# EAGLE design PL (EAGLE 9.4.2)
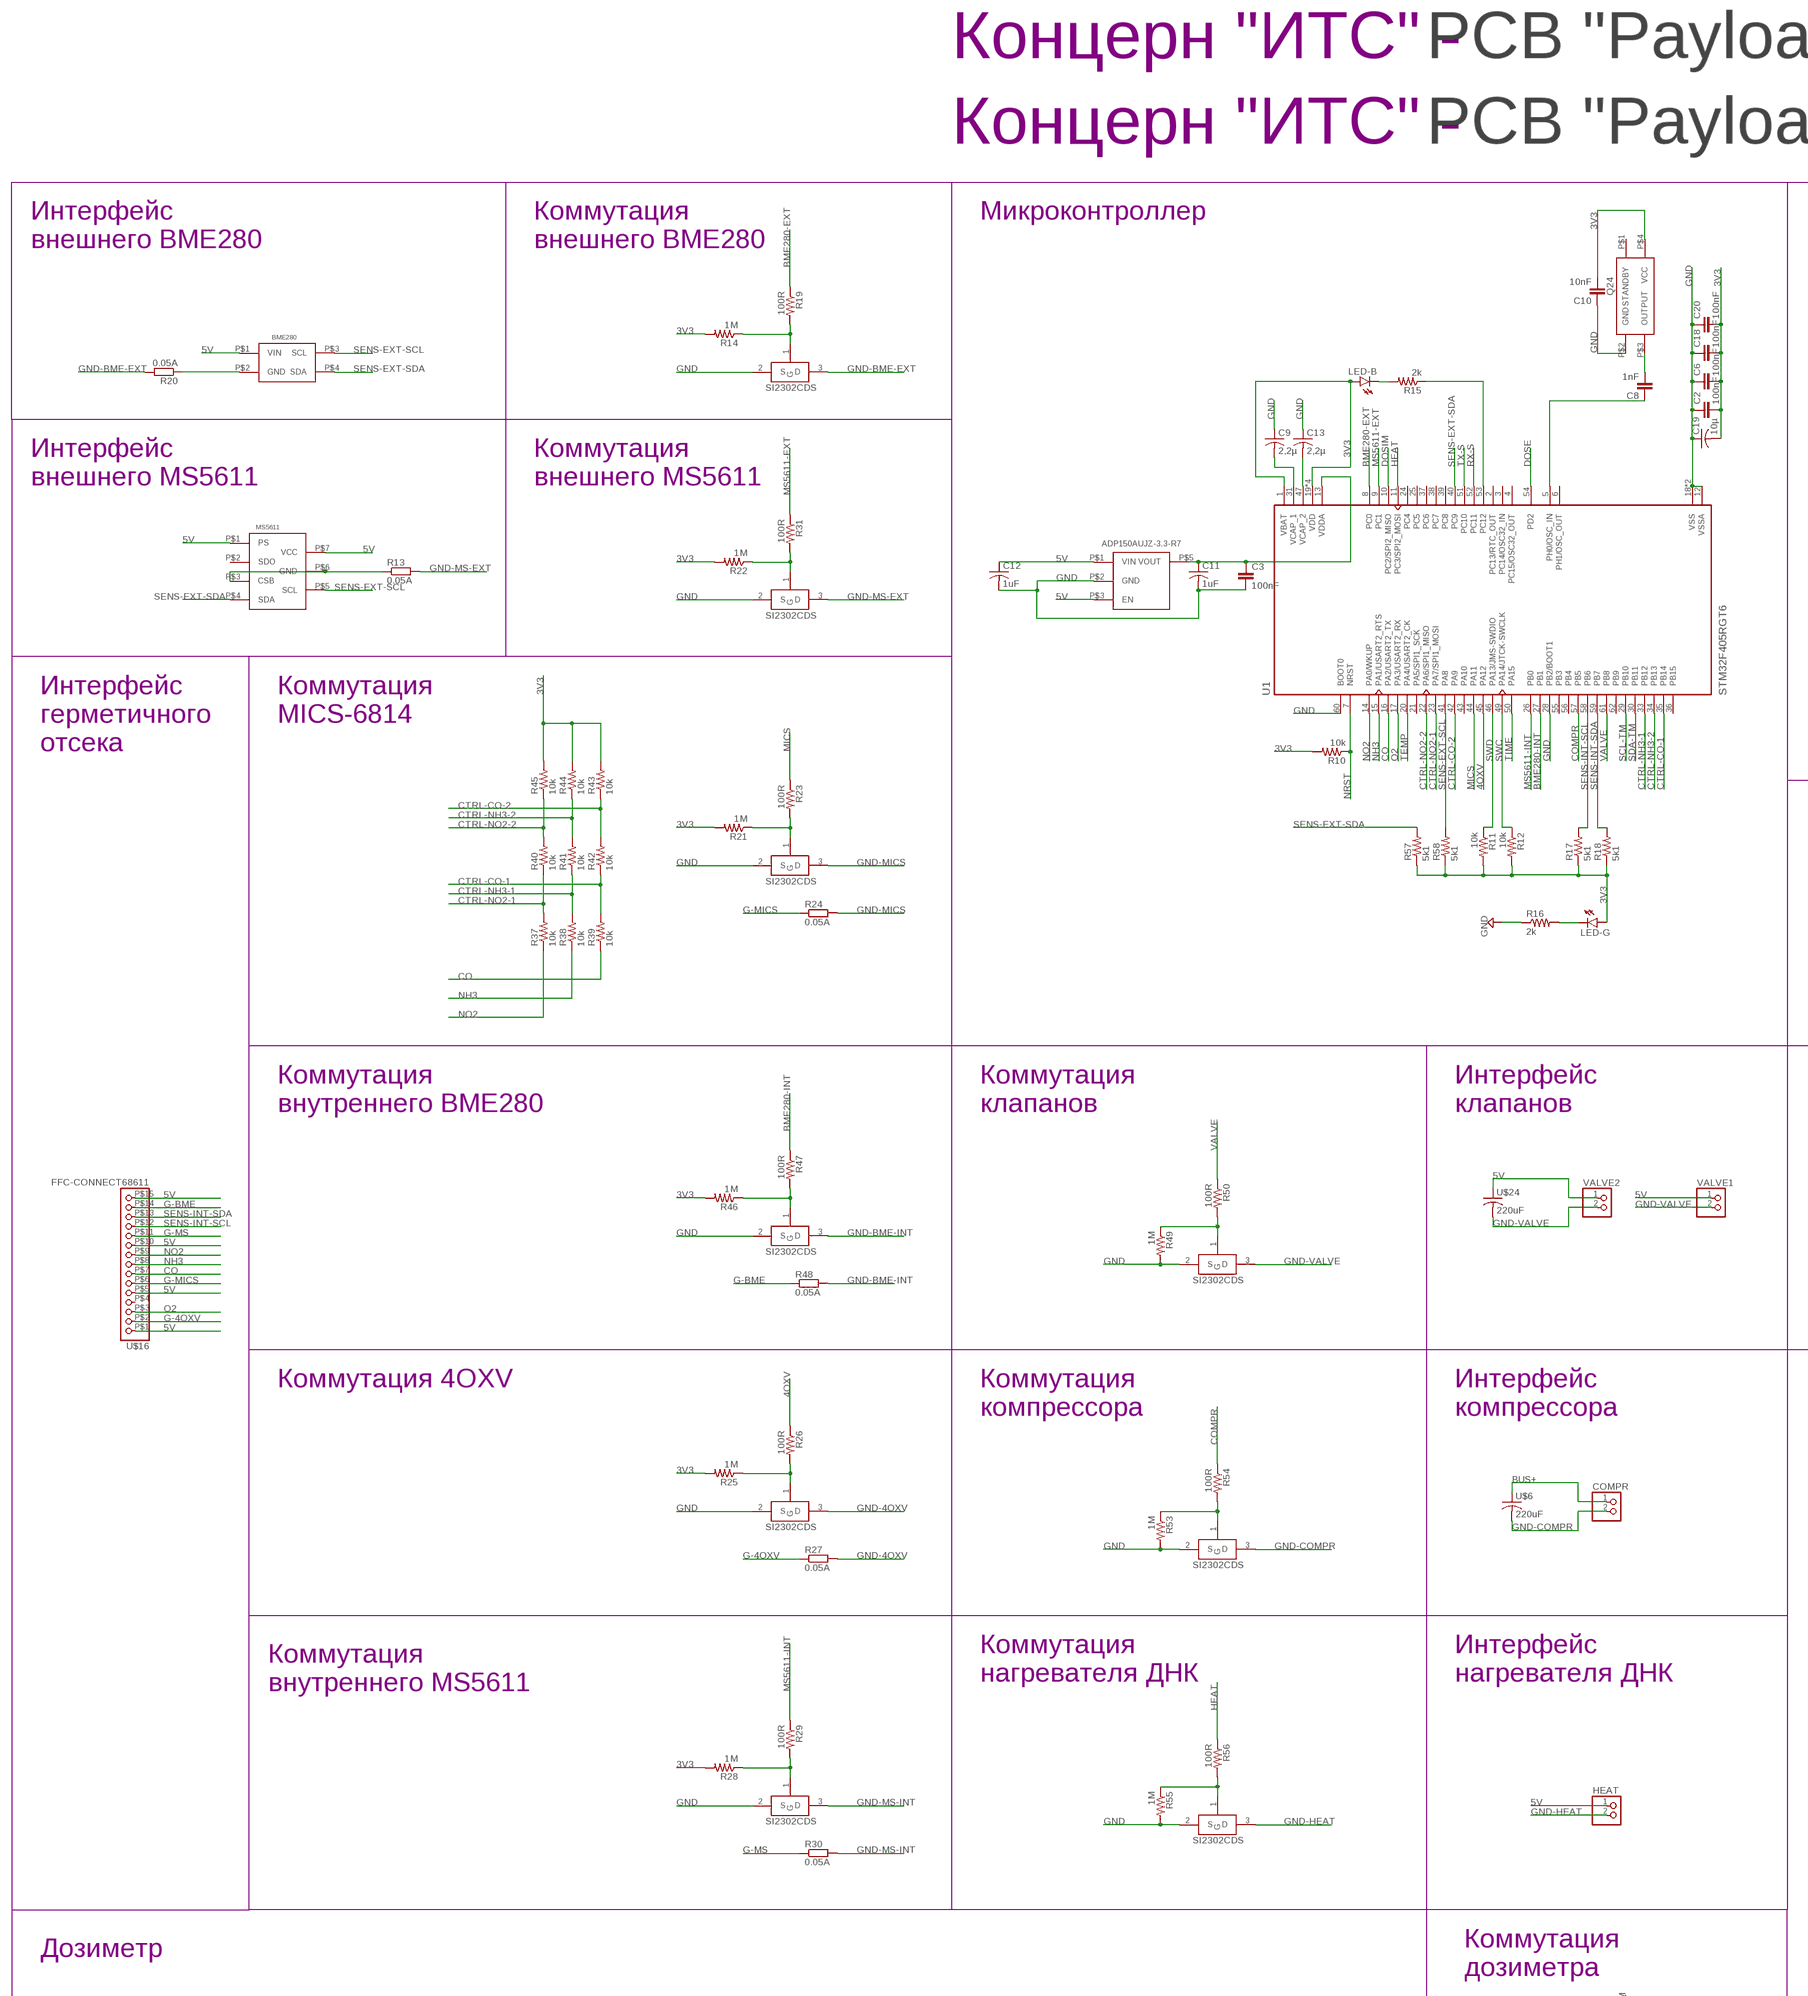
[diagram p0: schematic, sheet 1, part 1 of 3]
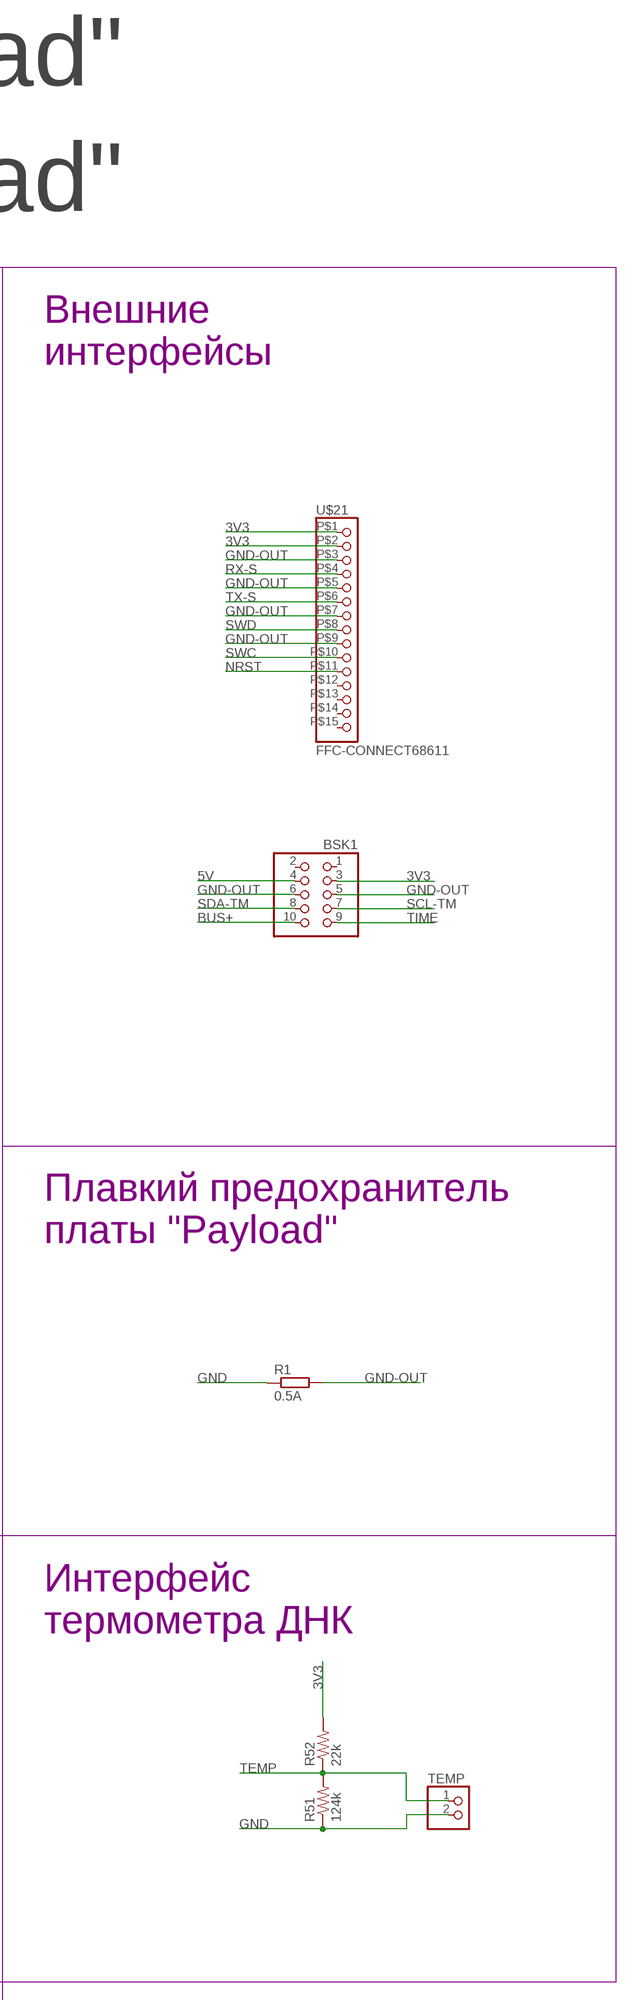
[diagram p1: schematic, sheet 1, part 2 of 3]
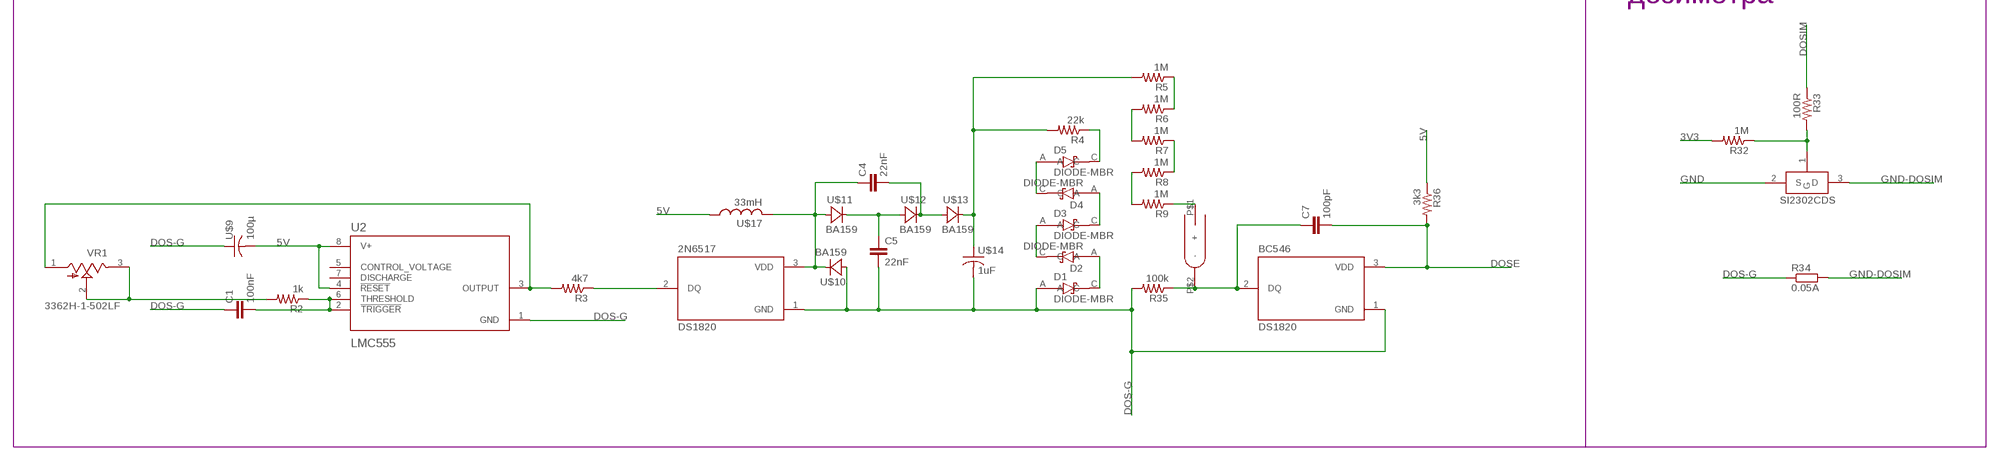
[diagram p2: schematic, sheet 1, part 3 of 3]

## Parts
2N6517  DS1820  [TO92/TO226]
BC546  DS1820  [TO92/TO226]
BME280  BME280BME280-PINS-ONLY  [BME280-PINS-ONLY]
BSK1  PINHD-2X5  [2X05]
C1  100nF  C-EUC0603  [C0603]
C2  100nF  C-EUC0603  [C0603]
C3  100nF  C-EUC0603  [C0603]
C4  22nF  C-EUC1210  [C1210]
C5  22nF  C-EUC1210  [C1210]
C6  100nF  C-EUC0603  [C0603]
C7  100pF  C-EUC0603  [C0603]
C8  1nF  C-EUC0603  [C0603]
C9  2,2µ  C-USC0603  [C0603]
C10  10nF  C-EUC0603  [C0603]
C11  1uF  ECAP1UF  [ECAP-SMD-D4]
C12  1uF  ECAP1UF  [ECAP-SMD-D4]
C13  2,2µ  C-USC0603  [C0603]
C18  100nF  C-EUC0603  [C0603]
C19  10µ  C-USC1206  [C1206]
C20  100nF  C-EUC0603  [C0603]
COMPR  PINHD-1X2  [1X02]
D1  DIODE-MBR  [SOD123]
D2  DIODE-MBR  [SOD123]
D3  DIODE-MBR  [SOD123]
D4  DIODE-MBR  [SOD123]
D5  DIODE-MBR  [SOD123]
HEAT  PINHD-1X2  [1X02]
LED-B  LEDCHIPLED_0603  [CHIPLED_0603]
LED-G  LEDCHIPLED_0603  [CHIPLED_0603]
MS5611  MS5611MS5611-PIN-ONLY  [MS5611-PINS-ONLY]
Q24  Q24  [Q24]
R1  0.5A  R-EU_R1210  [R1210]
R2  1k  R-US_R0603  [R0603]
R3  4k7  R-US_R0603  [R0603]
R4  22k  R-US_R0603  [R0603]
R5  1M  R-US_R0603  [R0603]
R6  1M  R-US_R0603  [R0603]
R7  1M  R-US_R0603  [R0603]
R8  1M  R-US_R0603  [R0603]
R9  1M  R-US_R0603  [R0603]
R10  10k  R-US_R0603  [R0603]
R11  10k  R-US_R0603  [R0603]
R12  10k  R-US_R0603  [R0603]
R13  0.05A  R-EU_R1210  [R1210]
R14  1M  R-US_R0603  [R0603]
R15  2k  R-US_R0603  [R0603]
R16  2k  R-US_R0603  [R0603]
R17  5k1  R-US_R0603  [R0603]
R18  5k1  R-US_R0603  [R0603]
R19  100R  R-US_R0603  [R0603]
R20  0.05A  R-EU_R1210  [R1210]
R21  1M  R-US_R0603  [R0603]
R22  1M  R-US_R0603  [R0603]
R23  100R  R-US_R0603  [R0603]
R24  0.05A  R-EU_R1210  [R1210]
R25  1M  R-US_R0603  [R0603]
R26  100R  R-US_R0603  [R0603]
R27  0.05A  R-EU_R1210  [R1210]
R28  1M  R-US_R0603  [R0603]
R29  100R  R-US_R0603  [R0603]
R30  0.05A  R-EU_R1210  [R1210]
R31  100R  R-US_R0603  [R0603]
R32  1M  R-US_R0603  [R0603]
R33  100R  R-US_R0603  [R0603]
R34  0.05A  R-EU_R1210  [R1210]
R35  100k  R-US_R0603  [R0603]
R36  3k3  R-US_R0603  [R0603]
R37  10k  R-US_R0603  [R0603]
R38  10k  R-US_R0603  [R0603]
R39  10k  R-US_R0603  [R0603]
R40  10k  R-US_R0603  [R0603]
R41  10k  R-US_R0603  [R0603]
R42  10k  R-US_R0603  [R0603]
R43  10k  R-US_R0603  [R0603]
R44  10k  R-US_R0603  [R0603]
R45  10k  R-US_R0603  [R0603]
R46  1M  R-US_R0603  [R0603]
R47  100R  R-US_R0603  [R0603]
R48  0.05A  R-EU_R1210  [R1210]
R49  1M  R-US_R0603  [R0603]
R50  100R  R-US_R0603  [R0603]
R51  124k  R-US_R0603  [R0603]
R52  22k  R-US_R0603  [R0603]
R53  1M  R-US_R0603  [R0603]
R54  100R  R-US_R0603  [R0603]
R55  1M  R-US_R0603  [R0603]
R56  100R  R-US_R0603  [R0603]
R57  5k1  R-US_R0603  [R0603]
R58  5k1  R-US_R0603  [R0603]
SI2302-0  SI2302CDS  [SOT23-3]
SI2302-1  SI2302CDS  [SOT23-3]
SI2302-2  SI2302CDS  [SOT23-3]
SI2302-3  SI2302CDS  [SOT23-3]
SI2302-4  SI2302CDS  [SOT23-3]
SI2302-5  SI2302CDS  [SOT23-3]
SI2302-6  SI2302CDS  [SOT23-3]
SI2302-7  SI2302CDS  [SOT23-3]
SI2302-8  SI2302CDS  [SOT23-3]
SI2302-9  SI2302CDS  [SOT23-3]
STAB  ADP150AUJZ-3.3-R7  [SOT23-5]
TEMP  PINHD-1X2  [1X02]
U1  STM32F405RGT6  [QFP50P1200X1200X160-64N]
U2  LMC555  LMC555CMX/NOPB  [SOIC127P599X175-8N]
U$1  PCB "Payload"  ITS-LOGOPCB-""  [ITS-LOGO]
U$6  220uF  ECAPECAP220  [ECAP220-CMD]
U$9  100µ  ECAPECAP100  [ECAP100-CMD]
U$10  BA159  [BA159]
U$11  BA159  [BA159]
U$12  BA159  [BA159]
U$13  BA159  [BA159]
U$14  1uF  ECAP  [ECAP1MK]
U$15  DOSIM  [DOSIM]
U$16  FFC-CONNECT68611  [68611]
U$17  33mH  RCH114NPRCH114NP  [RCH114NP]
U$21  FFC-CONNECT68611  [68611]
U$24  220uF  ECAPECAP220  [ECAP220-CMD]
U$26  PCB "Payload"  ITS-LOGOPCB-""  [ITS-LOGO]
VALVE1  PINHD-1X2  [1X02]
VALVE2  PINHD-1X2  [1X02]
VR1  3362H-1-502LF  [TRIM_3362H-1-502LF]

## Nets
3V3: BSK1.3 C2.2 C6.2 C10.2 C18.2 C19.2 C20.2 LED-B.A LED-G.A Q24.P$4(VCC) R10.2 R11.2 R12.2 R14.2 R17.1 R18.1 R21.2 R22.2 R25.2 R28.2 R32.2 R43.2 R44.2 R45.2 R46.2 R52.2 R57.1 R58.1 U1.1(VBAT) U1.19(VDD) U1.32(VDD) U1.48(VDD) U1.64(VDD) U$21.P$1 U$21.P$2
4OXV: R26.1 U1.45(PA12)
5V: BME280.P$1(VIN) BSK1.4 C12.P+ HEAT.1 MS5611.P$1(PS) MS5611.P$7(VCC) R36.1 STAB.P$1(VIN) STAB.P$3(EN) U2.4(!RESET!) U2.8(V+) U$9.P$2 U$16.P$1 U$16.P$5 U$16.P$10 U$16.P$15 U$17.P$1 U$24.P$1 VALVE1.1 VALVE2.1
BME280-EXT: R19.1 U1.8(PC0)
BME280-INT: R47.1 U1.27(PB1)
BUS+: BSK1.10 COMPR.1 U$6.P$1
CO: R39.1 U1.16(PA2/USART2_TX) U$16.P$7
COMPR: R54.1 U1.57(PB5)
CTRL-CO-1: R39.2 R42.1 U1.35(PB14)
CTRL-CO-2: R42.2 R43.1 U1.42(PA9)
CTRL-NH3-1: R38.2 R41.1 U1.33(PB12)
CTRL-NH3-2: R41.2 R44.1 U1.34(PB13)
CTRL-NO2-1: R37.2 R40.1 U1.23(PA7/SPI1_MOSI)
CTRL-NO2-2: R40.2 R45.1 U1.22(PA6/SPI1_MISO)
DOS-G: 2N6517.1(GND) BC546.1(GND) C1.1 C5.2 D1.A R34.1 R35.2 U2.1(GND) U$9.P$1 U$10.P$1(A) U$14.P$2
DOSE: BC546.3(VDD) C7.2 R36.2 U1.54(PD2)
DOSIM: R33.1 U1.10(PC2/SPI2_MISO)
G-4OXV: R27.1 U$16.P$2
G-BME: R48.1 U$16.P$14
G-MICS: R24.1 U$16.P$6
G-MS: R30.1 U$16.P$11
GND: C2.1 C3.2 C6.1 C9.1 C10.1 C11.P- C12.P- C13.1 C18.1 C19.1 C20.1 Q24.P$2(GND) R1.1 R16.1 R49.2 R51.1 R53.2 R55.2 SI2302-0.2(S) SI2302-1.2(S) SI2302-2.2(S) SI2302-3.2(S) SI2302-4.2(S) SI2302-5.2(S) SI2302-6.2(S) SI2302-7.2(S) SI2302-8.2(S) SI2302-9.2(S) STAB.P$2(GND) TEMP.2 U1.12(VSSA) U1.18(VSS) U1.28(PB2/BOOT1) U1.60(BOOT0) U1.63(VSS)
GND-4OXV: R27.2 SI2302-8.3(D)
GND-BME-EXT: R20.2 SI2302-2.3(D)
GND-BME-INT: R48.2 SI2302-5.3(D)
GND-COMPR: COMPR.2 SI2302-9.3(D) U$6.P$2
GND-DOSIM: R34.2 SI2302-4.3(D)
GND-HEAT: HEAT.2 SI2302-3.3(D)
GND-MICS: R24.2 SI2302-7.3(D)
GND-MS-EXT: R13.2 SI2302-1.3(D)
GND-MS-INT: R30.2 SI2302-6.3(D)
GND-OUT: BSK1.5 BSK1.6 R1.2 U$21.P$3 U$21.P$5 U$21.P$7 U$21.P$9
GND-VALVE: SI2302-0.3(D) U$24.P$2 VALVE1.2 VALVE2.2
HEAT: R56.1 U1.11(PC3/SPI2_MOSI)
MICS: R23.1 U1.44(PA11)
MS5611-EXT: R31.1 U1.9(PC1)
MS5611-INT: R29.1 U1.26(PB0)
N$1: MS5611.P$3(CSB) MS5611.P$6(GND) R13.1
N$2: R14.1 R19.2 SI2302-2.1(G)
N$3: BME280.P$2(GND) R20.1
N$4: C8.2 Q24.P$3(OUTPUT)
N$5: C8.1 U1.5(PH0/OSC_IN)
N$6: R21.1 R23.2 SI2302-7.1(G)
N$7: R49.1 R50.2 SI2302-0.1(G)
N$8: R25.1 R26.2 SI2302-8.1(G)
N$9: C3.1 C11.P+ STAB.P$5(VOUT) U1.13(VDDA)
N$10: R46.1 R47.2 SI2302-5.1(G)
N$11: R22.1 R31.2 SI2302-1.1(G)
N$12: R28.1 R29.2 SI2302-6.1(G)
N$13: LED-G.C R16.2
N$14: R32.1 R33.2 SI2302-4.1(G)
N$15: C1.2 R2.1 U2.2(!TRIGGER!) U2.6(THRESHOLD)
N$16: R2.2 VR1.2(WIPER) VR1.3(CW)
N$17: R3.2 U2.3(OUTPUT) VR1.1(CCW)
N$18: 2N6517.2(DQ) R3.1
N$19: 2N6517.3(VDD) C4.1 U$10.P$2(C) U$11.P$1(A) U$17.P$2
N$20: C5.1 U$11.P$2(C) U$12.P$1(A)
N$21: C4.2 U$12.P$2(C) U$13.P$1(A)
N$22: R4.2 R5.2 U$13.P$2(C) U$14.P$1
N$23: D1.C D2.A
N$24: D2.C D3.A
N$25: D3.C D4.A
N$26: D4.C D5.A
N$27: D5.C R4.1
N$28: R5.1 R6.1
N$29: C13.2 U1.47(VCAP_2)
N$30: R6.2 R7.2
N$31: R7.1 R8.1
N$32: R8.2 R9.2
N$33: R9.1 U$15.P$1(+)
N$34: BC546.2(DQ) C7.1 R35.1 U$15.P$2(-)
N$36: C9.2 U1.31(VCAP_1)
N$37: LED-B.C R15.2
N$38: R15.1 U1.53(PC12)
N$47: R53.1 R54.2 SI2302-9.1(G)
N$48: R55.1 R56.2 SI2302-3.1(G)
NH3: R38.1 U1.15(PA1/USART2_RTS) U$16.P$8
NO2: R37.1 U1.14(PA0/WKUP) U$16.P$9
NRST: R10.1 U1.7(NRST) U$21.P$11
O2: U1.17(PA3/USART2_RX) U$16.P$3
RX-S: U1.52(PC11) U$21.P$4
SCL-TM: BSK1.7 U1.29(PB10)
SDA-TM: BSK1.8 U1.30(PB11)
SENS-EXT-SCL: BME280.P$3(SCL) MS5611.P$5(SCL) R58.2 U1.41(PA8)
SENS-EXT-SDA: BME280.P$4(SDA) MS5611.P$4(SDA) R57.2 U1.40(PC9)
SENS-INT-SCL: R17.2 U1.58(PB6) U$16.P$12
SENS-INT-SDA: R18.2 U1.59(PB7) U$16.P$13
SWC: R12.1 U1.49(PA14/JTCK-SWCLK) U$21.P$10
SWD: R11.1 U1.46(PA13/JMS-SWDIO) U$21.P$8
TEMP: R51.2 R52.1 TEMP.1 U1.20(PA4/USART2_CK)
TIME: BSK1.9 U1.50(PA15)
TX-S: U1.51(PC10) U$21.P$6
VALVE: R50.1 U1.61(PB8)
Unconnected: BSK1.1 BSK1.2 MS5611.P$2(SDO) Q24.P$1(STANDBY) U1.2(PC13/RTC_OUT) U1.3(PC14/OSC32_IN) U1.4(PC15/OSC32_OUT) U1.6(PH1/OSC_OUT) U1.21(PA5/SPI1_SCK) U1.24(PC4) U1.25(PC5) U1.36(PB15) U1.37(PC6) U1.38(PC7) U1.39(PC8) U1.43(PA10) U1.55(PB3) U1.56(PB4) U1.62(PB9) U2.5(CONTROL_VOLTAGE) U2.7(DISCHARGE) U$16.P$4 U$21.P$12 U$21.P$13 U$21.P$14 U$21.P$15

## Notes on the sheet
- Микроконтроллер
- Интерфейс
  внешнего BME280
- Коммутация
  внешнего BME280
- Внешние
  интерфейсы
- Интерфейс
  внешнего MS5611
- Коммутация
  внешнего MS5611
- Коммутация
  MICS-6814
- Интерфейс
  герметичного 
  отсека
- Плавкий предохранитель
  платы "Payload"
- Коммутация
  внутреннего BME280
- Коммутация
  клапанов
- Интерфейс
  клапанов
- Интерфейс
  термометра ДНК
- Коммутация 4OXV
- Коммутация
  компрессора
- Интерфейс
  компрессора
- Коммутация
  нагревателя ДНК
- Интерфейс
  нагревателя ДНК
- Коммутация
  внутреннего MS5611
- Дозиметр
- Коммутация
  дозиметра

## Library data of the parts
2N6517 BC546 = CanCubeSat:DS1820: Temperature Sensor Digital, Local -55°C ~ 125°C 7 b TO-92-3 Check prices <https://pricing.snapeda.com/parts/DS1820/Maxim%20Integrated/view-part?ref=eda>; AVAILABILITY: Bad; DESCRIPTION: Temperature Sensor Digital, Local -55°C ~ 125°C 9 b TO-92-3; MF: Maxim Integrated; MP: DS1820; PACKAGE: TO-226-3 Maxim; PRICE: None
BME280 = CanCubeSat:BME280
BSK1 = pinheadCS:PINHD-2X5: PIN HEADER
C1-C8 C10 C18 C20 = rcl:C-EU: CAPACITOR, European symbol; SPICEPREFIX: C
C9 C13 C19 = rcl:C-US: CAPACITOR, American symbol; SPICEPREFIX: C
C11 C12 U$6 U$9 U$14 U$24 = CanCubeSat:ECAP
COMPR HEAT TEMP VALVE1 VALVE2 = pinheadCS:PINHD-1X2: PIN HEADER
D1-D5 = CanCubeSat:DIODE-MBR: Rectifier, Schottky Power; Plastic Sod-123; 0.5 a @ +90c If; +125; 20v; 1000 Check prices <https://pricing.snapeda.com/parts/MBR0520LT1G/ON%20Semiconductor/view-part?ref=eda>; AVAILABILITY: Good; DESCRIPTION: Diode Schottky 20V 500mA Surface Mount SOD-123; MF: ON Semiconductor; MP: MBR0520LT1G; PACKAGE: SOD-123-2 ON Semiconductor; PRICE: None; PURCHASE-URL: https://pricing.snapeda.com/search/part/MBR0520LT1G/?ref=eda
LED-B LED-G = led:LED: LED OSRAM: - CHIPLED LG R971, LG N971, LY N971, LG Q971, LY Q971, LO R971, LY R971 LH N974, LH R974 LS Q976, LO Q976, LY Q976 LO Q996 - Hyper CHIPLED LW Q18S LB Q993, LB Q99A, LB R99A - SideLED LS A670, LO A670, LY A670, LG A670, LP A670 LB A673, LV A673, LT A673, LW A673 LH A674 LY A675 LS A676, LA A676, LO A676, LY A676, LW A676 LS A679, LY A679, LG A679 - Hyper Micro SIDELED® LS Y876, LA Y876, LO Y876, LY Y876 LT Y87S - SmartLED LW L88C, LW L88S LB L89C, LB L89S, LG L890 LS L89K, LO L89K, LY L89K LS L896, LA L896, LO L896, LY L896 - TOPLED LS T670, LO T670, LY T670, LG T670, LP T670 LSG T670, LSP T670, LSY T670, LOP T670, LYG T670 LG T671, LOG T671, LSG T671 LB T673, LV T673, LT T673, LW T673 LH T674 LS T676, LA T676, LO T676, LY T676, LB T676, LH T676, LSB T676, LW T676 LB T67C, LV T67C, LT T67C, LS T67K, LO T67K, LY T67K, LW E67C LS E67B, LA E67B, LO E67B, LY E67B, LB E67C, LV E67C, LT E67C LW T67C LS T679, LY T679, LG T679 LS T770, LO T770, LY T770, LG T770, LP T770 LB T773, LV T773, LT T773, LW T773 LH T774 LS E675, LA E675, LY E675, LS T675 LS T776, LA T776, LO T776, LY T776, LB T776 LHGB T686 LT T68C, LB T68C - Hyper Mini TOPLED® LB M676 - Mini TOPLED Santana® LG M470 LS M47K, LO M47K, LY M47K Source: http://www.osram.convergy.de LUXEON: - LUMILED® LXK2-PW12-R00, LXK2-PW12-S00, LXK2-PW14-U00, LXK2-PW14-V00 LXK2-PM12-R00, LXK2-PM12-S00, LXK2-PM14-U00 LXK2-PE12-Q00, LXK2-PE12-R00, LXK2-PE12-S00, LXK2-PE14-T00, LXK2-PE14-U00 LXK2-PB12-K00, LXK2-PB12-L00, LXK2-PB12-M00, LXK2-PB14-N00, LXK2-PB14-P00, LXK2-PB14-Q00 LXK2-PR12-L00, LXK2-PR12-M00, LXK2-PR14-Q00, LXK2-PR14-R00 LXK2-PD12-Q00, LXK2-PD12-R00, LXK2-PD12-S00 LXK2-PH12-R00, LXK2-PH12-S00 LXK2-PL12-P00, LXK2-PL12-Q00, LXK2-PL12-R00 Source: www.luxeon.com KINGBRIGHT: KA-3528ASYC Source: www.kingbright.com
MS5611 = CanCubeSat:MS5611
Q24 = CanCubeSat:Q24
R1 R13 R20 R24 R27 R30 R34 R48 = rcl:R-EU_: RESISTOR, European symbol; SPICEPREFIX: R
R2-R12 R14-R19 R21-R23 R25 R26 R28 R29 R31-R33 R35-R47 R49-R58 = resistor:R-US_: RESISTOR, American symbol
SI2302-0 SI2302-1-SI2302-9 = CanCubeSat:SI2302CDS
STAB = CanCubeSat:ADP150AUJZ-3.3-R7
U1 = STM32F405RGT6:STM32F405RGT6: High-performance foundation line, ARM Cortex-M4 core with DSP and FPU, 1 Mbyte Flash, 168 MHz CPU, ART Accelerator; DESCRIPTION: High-performance foundation line, ARM Cortex-M4 core with DSP and FPU, 1 Mbyte Flash, 168 MHz CPU, ART Accelerator; DIGI-KEY_PART_NUMBER: 497-11767-ND; DIGI-KEY_PURCHASE_URL: https://www.digikey.com/product-detail/en/stmicroelectronics/STM32F405RGT6/497-11767-ND/2754208?utm_source=snapeda&utm_medium=aggregator&utm_campaign=symbol; MF: STMicroelectronics; MP: STM32F405RGT6; PACKAGE: LQFP-64 STMicroelectronics
U2 = LMC555CMX_NOPB:LMC555CMX/NOPB: Worlds smallest 555 timer with low power, high accuracy and a Fmax of 3MHz 8-SOIC -40 to 85 Check prices <https://pricing.snapeda.com/parts/LMC555CMX/NOPB/Texas%20Instruments/view-part?ref=eda>; AVAILABILITY: Good; DESCRIPTION: Worlds smallest 555 timer with low power, high accuracy and a Fmax of 3MHz 8-SOIC -40 to 85; MF: Texas Instruments; MP: LMC555CMX/NOPB; PACKAGE: SOIC-8 Texas Instruments; PRICE: None; PURCHASE-URL: https://pricing.snapeda.com/search/part/LMC555CMX/NOPB/?ref=eda
U$1 U$26 = CanCubeSat:ITS-LOGO
U$10-U$13 = CanCubeSat:BA159
U$15 = CanCubeSat:DOSIM
U$16 U$21 = CanCubeSat:FFC-CONNECT
U$17 = CanCubeSat:RCH114NP
VR1 = CanCubeSat:3362H-1-502LF: Res Cermet Trimmer 50K Ohm 10% 1/2W 1(Elec)/1(Mech)Turn 2.77mm (6.6 X 6.99 X 4.7mm) Pin Thru-Hole Tube Check prices <https://pricing.snapeda.com/parts/3362P-1-502LF/Bourns/view-part?ref=eda>; AVAILABILITY: Good; DESCRIPTION: 5 kOhms 0.5W, 1/2W PC Pins Through Hole Trimmer Potentiometer Cermet 1 Turn Top Adjustment; MF: Bourns; MP: 3362P-1-502LF; PACKAGE: 3362P-1 Bourns Inc.; PRICE: None; PURCHASE-URL: https://pricing.snapeda.com/search/part/3362P-1-502LF/?ref=eda

## Board
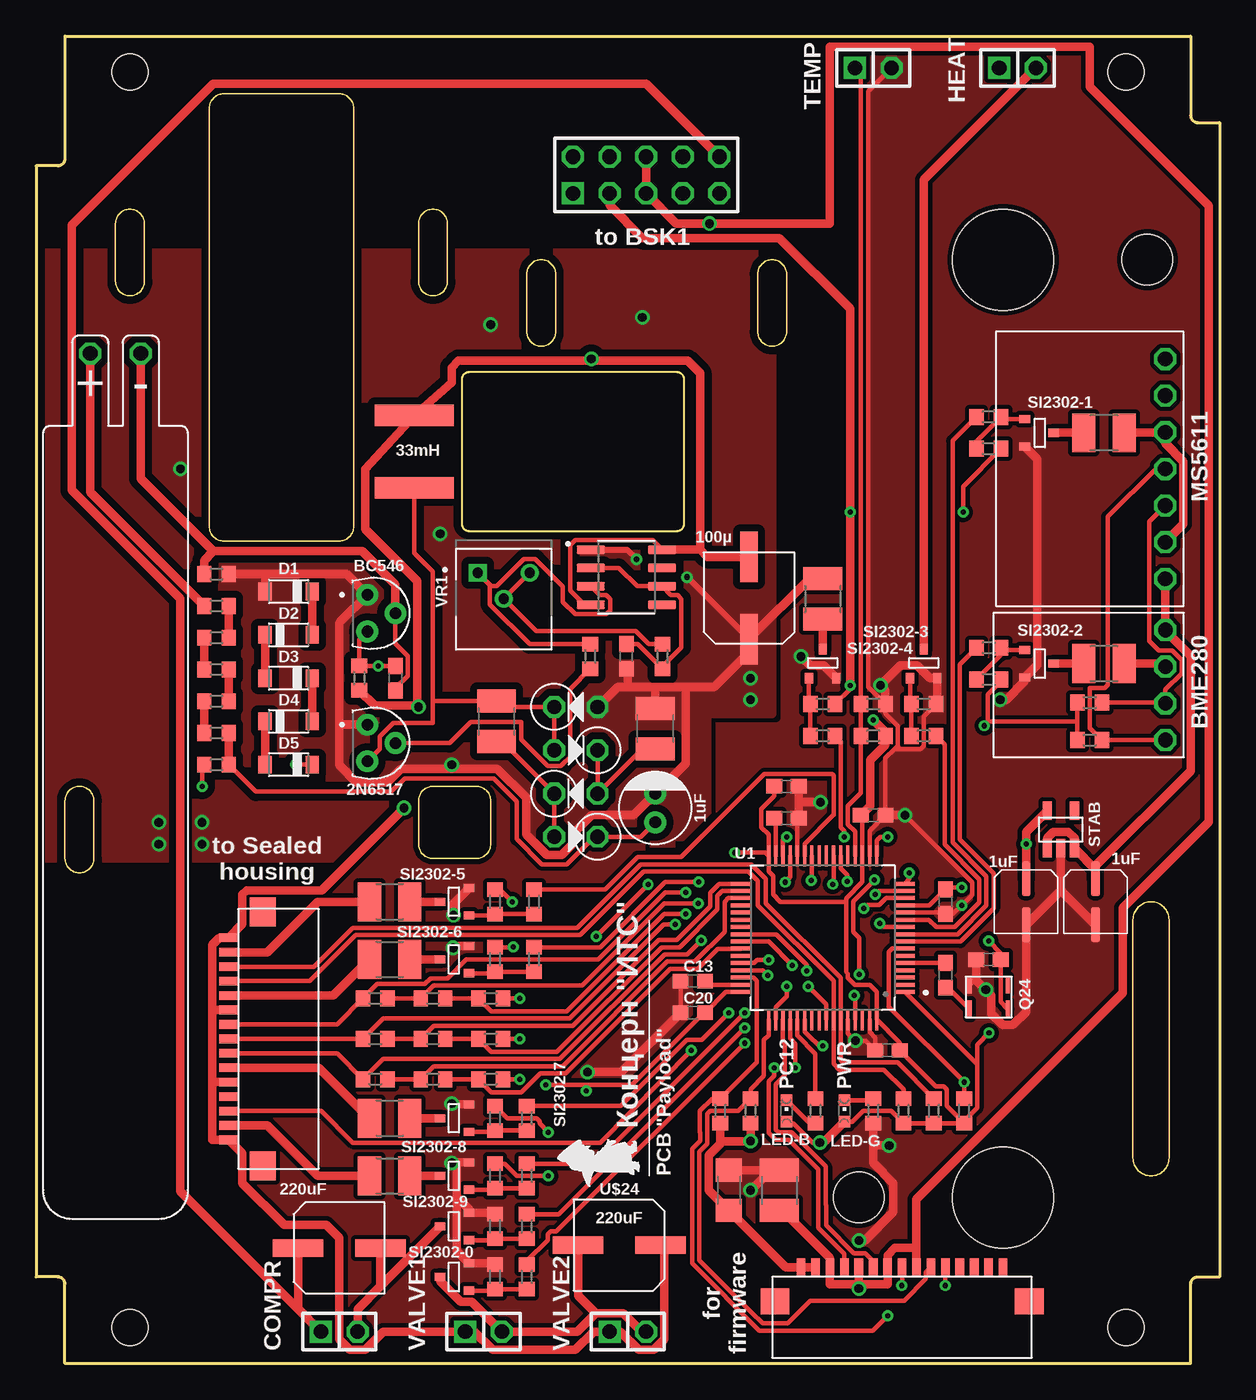
[diagram p3: board, top side]
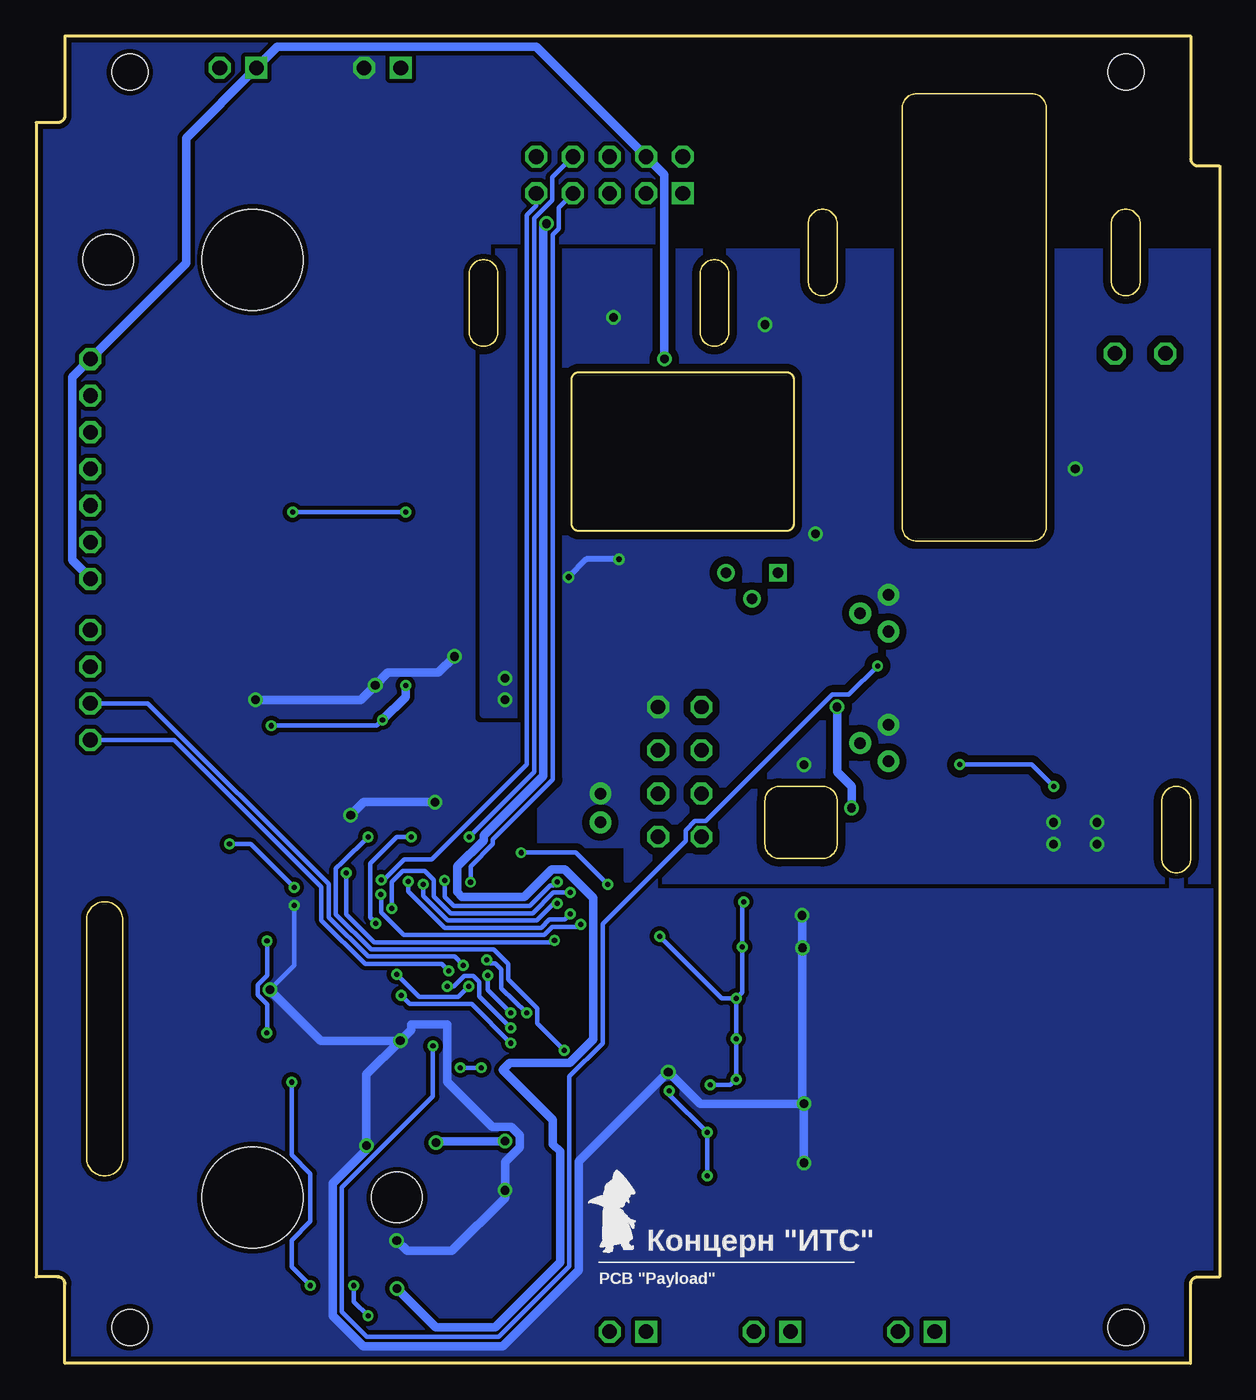
[diagram p4: board, bottom side, seen from below]

Size 82 x 92 mm. Coordinates in mm from the lower left corner, seen from the top.
Outline: 2,92 80,92 80,86.5 arc90 80.5,86 82,86 82,6 80.5,6 arc90 80,5.5 80,0 2,0 2,5.5 arc90 1.5,6 0,6 0,83 1.5,83 arc90 2,83.5 2,92
Outline: 2,39 2,35 arc180 4,35 4,39 arc180 2,39
Outline: 5.5,79 5.5,75 arc180 7.5,75 7.5,79 arc180 5.5,79
Outline: 26.5,79 26.5,75 arc180 28.5,75 28.5,79 arc180 26.5,79
Outline: 34,75.5 34,71.5 arc180 36,71.5 36,75.5 arc180 34,75.5
Outline: 50,75.5 50,71.5 arc180 52,71.5 52,75.5 arc180 50,75.5
Outline: 13,57 21,57 arc90 22,58 22,87 arc90 21,88 13,88 arc90 12,87 12,58 arc90 13,57
Outline: 26.5,39 26.5,36 arc90 27.5,35 30.5,35 arc90 31.5,36 31.5,39 arc90 30.5,40 27.5,40 arc90 26.5,39
Outline: 76,30.75 76,14.25 arc180 78.5,14.25 78.5,30.75 arc180 76,30.75
Copper layers (1*16): Top 0.035mm / dielectric 1.5mm / Bottom 0.035mm
Design rules "default *": minimum track width 0.2mm, minimum drill 0.35mm, track to track 0.2mm, track to pad 0.2mm, pad to pad 0.2mm, via to via 0.2mm, smd to smd 0.2mm, copper to edge 0.35mm, drill to drill 6mil, minimum pad ring 10mil, minimum via ring 8mil, stop-mask expansion 2mil, vias tented up to drill 0mil, thermal gap 10mil
Holes 2.5 mm at 6.5,2.5 75.5,2.5 75.5,89.5 6.5,89.5
Holes 3.5 mm at 57,11.5 77,76.5
Holes 7 mm at 67,11.5 67,76.5

### Footprints (pad centres in the part's own frame; a part is rotated, then mirrored left to right if it is on the bottom)
TO92/TO226 = drill 0.8 pad 1.5: 1 -1.27,-0.95; 2 0,1; 3 1.27,-0.95
BME280-PINS-ONLY = drill 1.016 octagon: P$1 -3.81,5.33; P$2 -1.27,5.33; P$3 1.27,5.33; P$4 3.81,5.33
2X05 = drill 1.016 square: 1 -5.08,-1.27 | drill 1.016 octagon: 2 -5.08,1.27; 3 -2.54,-1.27; 4 -2.54,1.27; 5 0,-1.27; 6 0,1.27; 7 2.54,-1.27; 8 2.54,1.27; 9 5.08,-1.27; 10 5.08,1.27
C0603 = smd 1.1 x 1: 1 -0.85,0; 2 0.85,0
C1210 = smd 1.6 x 2.7: 1 -1.4,0; 2 1.4,0
ECAP-SMD-D4 = smd 0.6 x 2.4: P+ 0,1.6; P- 0,-1.6
C1206 = smd 1.6 x 1.8: 1 -1.4,0; 2 1.4,0
1X02 = drill 1.016 square: 1 -1.27,0 | drill 1.016 octagon: 2 1.27,0
SOD123 = smd 0.91 x 1.22: A 1.635,0; C -1.635,0
CHIPLED_0603 = smd 0.8 x 0.8: A 0,-0.75; C 0,0.75
MS5611-PINS-ONLY = drill 1.016 octagon: P$1 -7.62,5.23; P$2 -5.08,5.23; P$3 -2.54,5.23; P$4 0,5.23; P$5 2.54,5.23; P$6 5.08,5.23; P$7 7.62,5.23
Q24 = smd 0.3 x 1.2: P$1 -1.325,-0.85; P$2 1.325,-0.85; P$3 1.325,0.85; P$4 -1.325,0.85
R1210 = smd 1.6 x 2.7: 1 -1.4,0; 2 1.4,0
R0603 = smd 1 x 1.1: 1 -0.85,0; 2 0.85,0
SOT23-3 = smd 0.56 x 0.73: 1 -0.95,-1; 2 0.95,-1; 3 0,1
SOT23-5 = smd 0.635 x 1.27: P$1 -0.95,-1.3; P$2 0,-1.3; P$3 0.95,-1.3; P$4 0.95,1.3; P$5 -0.95,1.3
QFP50P1200X1200X160-64N = smd 1.47 x 0.28: 1 -5.67,3.75; 2 -5.67,3.25; 3 -5.67,2.75; 4 -5.67,2.25; 5 -5.67,1.75; 6 -5.67,1.25; 7 -5.67,0.75; 8 -5.67,0.25; 9 -5.67,-0.25; 10 -5.67,-0.75; 11 -5.67,-1.25; 12 -5.67,-1.75; 13 -5.67,-2.25; 14 -5.67,-2.75; 15 -5.67,-3.25; 16 -5.67,-3.75; 33 5.67,-3.75; 34 5.67,-3.25; 35 5.67,-2.75; 36 5.67,-2.25; 37 5.67,-1.75; 38 5.67,-1.25; 39 5.67,-0.75; 40 5.67,-0.25; 41 5.67,0.25; 42 5.67,0.75; 43 5.67,1.25; 44 5.67,1.75; 45 5.67,2.25; 46 5.67,2.75; 47 5.67,3.25; 48 5.67,3.75 | smd 0.28 x 1.47: 17 -3.75,-5.67; 18 -3.25,-5.67; 19 -2.75,-5.67; 20 -2.25,-5.67; 21 -1.75,-5.67; 22 -1.25,-5.67; 23 -0.75,-5.67; 24 -0.25,-5.67; 25 0.25,-5.67; 26 0.75,-5.67; 27 1.25,-5.67; 28 1.75,-5.67; 29 2.25,-5.67; 30 2.75,-5.67; 31 3.25,-5.67; 32 3.75,-5.67; 49 3.75,5.67; 50 3.25,5.67; 51 2.75,5.67; 52 2.25,5.67; 53 1.75,5.67; 54 1.25,5.67; 55 0.75,5.67; 56 0.25,5.67; 57 -0.25,5.67; 58 -0.75,5.67; 59 -1.25,5.67; 60 -1.75,5.67; 61 -2.25,5.67; 62 -2.75,5.67; 63 -3.25,5.67; 64 -3.75,5.67
SOIC127P599X175-8N = smd 1.97 x 0.6: 1 -2.47,1.905; 2 -2.47,0.635; 3 -2.47,-0.635; 4 -2.47,-1.905; 5 2.47,-1.905; 6 2.47,-0.635; 7 2.47,0.635; 8 2.47,1.905
ECAP220-CMD = smd 1.2 x 3.5: P$1 0,2.85; P$2 0,-2.85
ECAP100-CMD = smd 1.2 x 3.5: P$1 0,2.85; P$2 0,-2.85
BA159 = drill 1 octagon: P$1 -1.5,0; P$2 1.5,0
ECAP1MK = drill 0.8 pad 1.5: P$1 -1,0; P$2 1,0
DOSIM = drill 1.016 octagon: P$1 -1.75,0; P$2 1.75,0
68611 = smd 0.6 x 1.3: P$1 -7,0.65; P$2 -6,0.65; P$3 -5,0.65; P$4 -4,0.65; P$5 -3,0.65; P$6 -2,0.65; P$7 -1,0.65; P$8 0,0.65; P$9 1,0.65; P$10 2,0.65; P$11 3,0.65; P$12 4,0.65; P$13 5,0.65; P$14 6,0.65; P$15 7,0.65 | smd 2 x 1.8: P$16 8.8,-1.7; P$17 -8.8,-1.7
RCH114NP = smd 5.5 x 1.5: P$1 3.8,-2.5; P$2 3.8,2.5
TRIM_3362H-1-502LF = drill 0.714 square: 1 -1.8,1.8 | drill 0.714: 2 0,0; 3 1.8,1.8

### Placement (x,y rotation side)
2N6517  23.9,43 270 top
BC546  23.9,52 270 top
BME280  72.92,47.02 270 top
BSK1  42.27,82.37 0 top
C1  40.9,49 90 top
C2  59,21.7 0 top
C3  63,32 270 top
C4  31.9,44.5 270 top
C5  42.9,44 90 top
C6  52,40 180 top
C7  24.9,47.5 90 top
C8  63,26.9 270 top
C9  52,37.8 180 top
C10  66,28 0 top
C11  68.6,32 0 top
C12  73.4,32 0 top
C13  45.5,26.5 0 top
C18  58,38 180 top
C19  48,12 270 top
C20  45.5,24.3 0 top
COMPR  21,2.2 0 top
D1  17.5,53.5 180 top
D2  17.5,50.5 0 top
D3  17.5,47.5 180 top
D4  17.5,44.5 0 top
D5  17.5,41.5 180 top
HEAT  68,89.8 0 top
LED-B  52,17.5 0 top
LED-G  56,17.5 0 top
MS5611  73,62 270 top
Q24  66,25.4 180 top
R1  51.5,12 270 top
R2  43.4,49 90 top
R3  38.4,49 90 top
R4  12.5,41.5 0 top
R5  12.5,43.7 0 top
R6  12.5,45.9 0 top
R7  12.5,48.1 0 top
R8  12.5,50.3 0 top
R9  12.5,52.5 0 top
R10  64.3,17.5 270 top
R11  47.4,17.5 270 top
R12  49.5,17.5 270 top
R13  74,64.5 180 top
R14  66,47.4 0 top
R15  54,17.5 270 top
R16  58,17.5 90 top
R17  60.1,17.5 90 top
R18  62.2,17.5 90 top
R19  66,49.6 0 top
R20  74,48.5 180 top
R21  31.8,17 90 top
R22  66,63.4 0 top
R23  34,17 270 top
R24  24.5,17 0 top
R25  31.8,13 90 top
R26  34,13 270 top
R27  24.5,13 0 top
R28  31.8,28 90 top
R29  34.5,28 270 top
R30  24.5,28 0 top
R31  66,65.6 0 top
R32  54.5,45.7 0 top
R33  54.5,43.5 180 top
R34  54.5,53 270 top
R35  12.5,54.7 0 top
R36  22.4,47.5 90 top
R37  23.5,25.3 0 top
R38  23.5,22.5 0 top
R39  23.5,19.7 0 top
R40  27.5,25.3 0 top
R41  27.5,22.5 0 top
R42  27.5,19.7 0 top
R43  31.5,19.7 0 top
R44  31.5,22.5 0 top
R45  31.5,25.3 0 top
R46  31.8,32 90 top
R47  34.5,32 270 top
R48  24.5,32 0 top
R49  31.8,6 90 top
R50  34,6 270 top
R51  58,45.7 180 top
R52  58,43.5 0 top
R53  31.8,9.5 90 top
R54  34,9.5 270 top
R55  61.5,45.7 0 top
R56  61.5,43.5 180 top
R57  73,43.2 0 top
R58  73,45.8 0 top
SI2302-0  29,6 90 top
SI2302-1  69.5,64.5 270 top
SI2302-2  69.5,48.5 270 top
SI2302-3  61.5,48.5 0 top
SI2302-4  54.5,48.5 0 top
SI2302-5  29,32 90 top
SI2302-6  29,28 90 top
SI2302-7  29,17 90 top
SI2302-8  29,13 90 top
SI2302-9  29,9.5 90 top
STAB  71,37 0 top
TEMP  58,89.8 0 top
U1  54.5,29.5 180 top
U2  40.9,54.5 0 top
U$1  42.5,13 90 top
U$6  21,8 90 top
U$9  49.4,53.05 180 top
U$10  37.4,45.5 180 top
U$11  37.4,42.5 0 top
U$12  37.4,39.5 180 top
U$13  37.4,36.5 0 top
U$14  42.9,38.5 90 top
U$15  5.5,70 0 top
U$16  14,22.5 90 top
U$17  30,63.2 180 top
U$21  60,6 0 top
U$24  40.4,8.2 270 top
U$26  43,7 0 bottom
VALVE1  31,2.2 0 top
VALVE2  41,2.2 0 top
VR1  32.4,53 0 top

### Tracks (layer width: path | path; a pad name or v marks a point on that pad's centre or on a via)
3V3  (via drill 0.35, 0.6)
  Top 0.3: LED-B.A 51.9,16.65 52.45,16.65 53.8,15.3 v54.3,15.3 | R10.2 63.1,17.85 63.1,19 62.9,19.2 62.35,19.2 C2.2 59.85,22.23 U1.64 58.25,25.75 57.76,26.24 56.72,26.24 56.25,26.71 56.25,27 56.12,27.13 56.12,32 | C18.2 57.25,37.9 U1.19 57.25,33.36 56.12,32.23 56.12,32 | U1.48 47.8,25.75 C20.2 46.26,24.3 41.26,19.3 38,19.3 | R45.2 v33.5,25.3 | v33.5,22.5 R44.2 | R43.2 v33.5,19.7 | C6.2 51.15,39.34 50.25,38.45 50.25,37.16 50.75,36.66 U1.32 | 38,19.3 v35.3,19.3 | Q24.P$4 66.83,25.05 66.83,27.98 C10.2 66.85,28.42 v66,29.27 | U1.32 50.52,35.4 v48.4,35.4 | v42.4,33.2 v38.8,29.6 | R10.2 64.3,16.8 65.2,17.7 65.2,20.72 | U1.1 65.2,20.72 | v66.02,22.9 65.2,22.08 65.2,20.72 | U1.32 50.75,34.09 51.07,33.77 51.07,32.5 51.57,32 56.12,32 | R25.2 32.45,13.85 33.3,13 v35.5,13 | v35.5,16.03 34.9,16.63 34.9,16.8 34.7,17 32.65,17 R21.2 | 38,19.3 38.12,19.18 v38.12,18.88 | R28.2 33.05,28.85 v33.07,28.87 | v32.98,32 32.13,32.85 R46.2 | v56.4,47 56.4,46.75 R32.2 | R14.2 66.85,47.26 65.95,46.35 65.95,44.45 v65.7,44.2 66,44.5 72.15,44.5 | R22.2 64.23,60.78 v64.23,59 | LED-G.A 56.55,16.75 57.3,17.5 59.25,17.5 R17.1 R18.1 R10.2 | R58.1 72.15,44.5 | 72.15,44.5 R57.1
  Top 0.6: U$21.P$2 U$21.P$1 51.95,6.65 C19.2 46.6,12 46.6,14.41 47.4,15.21 47.4,15.4 | 47.4,15.4 v49.5,15.4 R12.2 | v56.4,47 v56.4,59 56.4,73.1 51.5,78 47.07,78 47.06,78 46.23,78 42,78 39.73,80.27 BSK1.3 | v58,44.6 58.85,43.75 R52.2 58.85,42.87 57.8,41.82 57.8,38.65 C18.2 | v54.3,15.3 54.55,15.3 LED-G.A | 47.4,15.4 R11.2
  Bottom 0.3: v33.5,25.3 v33.5,22.5 v33.5,19.7 33.9,19.3 v35.3,19.3 | v48.4,35.4 44.6,35.4 v42.4,33.2 | v38.8,29.6 34.5,25.3 v33.5,25.3 | v66.02,22.9 66,22.92 66,24.89 66.65,25.55 66.65,26.25 66,26.91 v66,29.27 | v35.5,13 35.5,16 | 35.5,16 v35.5,16.03 | v38.12,18.88 38.12,18.62 35.5,16 | v32.98,32 33.07,31.91 v33.07,28.87 33.07,25.73 v33.5,25.3 | v65.7,44.2 58.4,44.2 v58,44.6 | v64.23,59 v56.4,59
  Bottom 0.6: v54.3,15.3 54.2,15.4 v49.5,15.4 | v56.4,47 56.4,46.2 v58,44.6
4OXV  (via drill 0.35)
  Top 0.3: R26.1 38.67,13.85 v49.1,24.3 | U1.45 50.35,27.25 v50.7,26.9
  Bottom 0.3: v49.1,24.3 50.7,25.88 v50.7,26.9
5V  (via drill 0.6)
  Top 0.3: U2.8 42.72,57.05 37.34,57.05 37,56.71 37,53.56 37.96,52.59 U2.4
  Top 0.6: 26.4,45.6 26.4,54.22 22.8,57.82 22.8,61.98 U$17.P$1 28.79,67.99 28.79,69.03 29.25,69.5 38.5,69.5 | R36.1 23.45,45.6 26.4,45.6 | 38.5,69.5 38.47,69.53 v38.47,69.62 | 38.5,69.5 45.15,69.5 46,68.65 46,56.41 | 46,56.41 46.51,55.9 U$9.P$2 | 46,56.41 U2.8 | 12.2,24.5 12.2,29.01 12.69,29.5 U$16.P$15 14.3,30.45 14.3,32.51 14.59,32.8 19.8,32.8 v25.5,38.5 | 12.2,24.5 U$16.P$10 | U$16.P$5 12.2,19.5 | 12.2,19.5 12.2,15.5 U$16.P$1 14.3,14.55 14.3,12.49 17.19,9.6 20.11,9.6 21.01,8.7 21.01,1.68 21.75,0.94 22.79,0.94 24.05,2.2 VALVE1.1 30.37,2.2 31.63,0.94 37.37,0.94 38.63,2.2 VALVE2.1 40.48,2.2 41.75,0.94 42.79,0.94 43.53,1.68 43.53,7.92 U$24.P$1 | 12.2,19.5 12.2,24.5 | v26.5,45.5 26.4,45.6 | MS5611.P$7 78.23,50.85 BME280.P$1 78.25,50.78 80.01,49.02 80.01,41.08 73.4,34.47 C12.P+ 73.4,34.25 STAB.P$3 71.95,36.41 71.53,36.84 70.47,36.84 70.05,36.41 STAB.P$1
  Bottom 0.3: 78.2,54.4 MS5611.P$7
  Bottom 0.6: v26.5,45.5 26.5,41 25.5,40 v25.5,38.5 | 78.2,54.4 79.49,55.69 79.49,68.36 MS5611.P$1 71.6,76.25 71.6,84.93 HEAT.1 65.28,91.25 47.34,91.25 BSK1.4 38.47,82.38 v38.47,69.62
BME280-EXT
  Top 0.3: R19.1 64,48.45 64,36.32 66.35,33.97 66.35,31.54 64.06,29.25 U1.8
BME280-INT
  Top 0.3: U1.27 53.25,36.02 55.23,38 55.25,38 55.25,40.75 55.15,40.85 50.45,40.85 44.7,35.1 41.68,35.1 39.44,32.85 R47.1
BUS+
  Top 0.6: U$6.P$1 18.15,3.78 COMPR.1 10,11.93 10,53.02 2.49,60.53 2.49,78.9 12.29,88.7 42.29,88.7 BSK1.10
CO  (via drill 0.35)
  Top 0.3: U$16.P$7 20.85,21.5 R39.1 24.05,21.1 36.29,21.1 43.54,28.35 45.11,28.35 v46.08,29.32 | v60.5,34 60.5,33.58 U1.16
  Bottom 0.3: v60.5,34 60.5,31.11 58.58,29.2 46.2,29.2 v46.08,29.32
COMPR  (via drill 0.35)
  Top 0.3: U1.57 54.75,24.89 v53.5,26.14 | v49.1,23.25 36.2,10.35 R54.1
  Bottom 0.3: v49.1,23.25 51.29,25.45 51.29,26.45 51.72,26.87 52.32,26.87 53.05,26.14 v53.5,26.14
CTRL-CO-1
  Top 0.3: R39.2 R42.1 27.55,20.6 36.5,20.6 43.75,27.85 45.64,27.85 47.7,29.91 47.7,32 47.95,32.25 U1.35
CTRL-CO-2
  Top 0.3: R42.2 R43.1 31.55,18.8 33.63,18.8 34.93,20.1 36.7,20.1 43.95,27.35 45.85,27.35 47.24,28.74 U1.42
CTRL-NH3-1
  Top 0.3: R38.2 R41.1 27.55,23.4 37.18,23.4 43.13,29.35 44.38,29.35 46.7,31.67 46.7,32.61 47.34,33.25 U1.33
CTRL-NH3-2
  Top 0.3: R41.2 R44.1 31.55,21.6 36.08,21.6 43.33,28.85 44.58,28.85 47.2,31.47 47.2,32.41 47.54,32.75 U1.34
CTRL-NO2-1  (via drill 0.35)
  Top 0.3: R37.2 R40.1 27.55,26.2 37.85,26.2 43.54,31.88 v45.88,31.88 | U1.23 55.25,33.15 v55.19,33.22
  Bottom 0.3: v45.88,31.88 46.12,31.88 47.3,30.7 53.49,30.7 55.19,32.39 v55.19,33.22
CTRL-NO2-2  (via drill 0.35)
  Top 0.3: v45,31.16 43.52,31.16 36.76,24.4 31.55,24.4 R45.1 R40.2 | U1.22 55.76,34.31 56.2,33.87 v56.2,33.4
  Bottom 0.3: v45,31.16 45.38,30.77 46.44,30.77 47.01,30.2 53.7,30.2 56.2,32.7 v56.2,33.4
DOS-G  (via drill 0.4, 0.6)
  Top 0.3: 21.09,51.41 21,51.32 | 49.6,50.4 U$9.P$1
  Top 0.4: U$9.P$1 v45.1,54.5 | v41.6,55.73 40.94,56.41 U2.1
  Top 0.6: 49.6,50.4 53.6,54.4 R34.1 | 41,46.9 40.3,46.9 U$10.P$1 | 41,46.9 43,46.9 | 43,46.9 45,46.9 | 45,46.9 47,46.9 49.4,49.3 U$9.P$1 | C1.1 41,48.05 41,46.9 | C5.2 42.9,46.8 43,46.9 | 21.09,51.41 BC546.1 21.52,54.7 15.87,54.7 | 21,44.27 21,41.48 22.2,40.28 24.34,40.28 25.26,41.2 28.5,41.2 28.8,41.2 | 21,44.27 21,51.32 | 45,46.9 45,41.6 U$14.P$2 41.4,38 38.5,38 37.15,36.65 37.15,35.98 36.42,35.25 35.38,35.25 33.95,36.68 33.95,39.22 31.96,41.2 28.8,41.2 | 2N6517.1 21,44.27 | R35.2 15.87,54.7 | D1.A 15.87,54.7 | v28.8,41.5 28.8,41.2
  Bottom 0.4: v41.6,55.73 43.87,55.73 v45.1,54.5
  other vias: 49.5,46 49.5,47.5 42,72.5 31.5,72 8.5,37.5 11.5,37.5 8.5,36 11.5,36 10,62 28,57.5
  pour Top (isolate 0.5, no thermals): 0,77 51,77 51,51.5 51,45 48,45 46.5,45 46.5,36.5 44,36.5 44,35 0,35
  pour Bottom (isolate 0.5, no thermals): 0,77 51,77 51,45 47,45 47,36 41,36 41,33.5 0,33.5
DOSE  (via drill 0.35)
  Top 0.3: BC546.3 22.4,50.18 R36.2 v23.7,48.35 C7.2 | U1.54 53.25,22.98 53.49,22.75 53.5,22.75 54.24,22 v54.5,22
  Bottom 0.3: v23.7,48.35 25.7,46.35 26.85,46.35 35.6,37.6 36.36,37.6 37,36.96 37,36.2 42.74,30.46 42.74,22.19 45.05,19.89 45.05,6.73 49.93,1.85 59.08,1.85 60.81,3.58 60.81,12.2 54.5,18.51 v54.5,22
DOSIM  (via drill 0.35)
  Top 0.3: U1.10 58.71,30.25 v58.46,30.5 | v56,36.5 56,36.9 55.75,37.15 55.75,43.1 R33.1
  Bottom 0.3: v56,36.5 57,36.5 58.86,34.64 58.86,30.9 v58.46,30.5
G-4OXV
  Top 0.6: U$16.P$2 16,16.5 19.5,13 R27.1
G-BME
  Top 0.6: U$16.P$14 16,28.5 19.5,32 R48.1
G-MICS
  Top 0.6: R24.1 19.6,20.5 U$16.P$6
G-MS
  Top 0.6: R30.1 20.6,25.5 U$16.P$11
GND  (via drill 0.35, 0.6)
  Top 0.3: TEMP.2 57.65,88.18 57.65,46.9 R51.1 58.85,45.5 58.85,45.05 59.7,44.2 59.7,42.8 59.49,42.6 | 59.49,42.6 58.85,41.95 C18.1 57.75,36.9 U1.18 | C13.1 C20.1 | R55.2 61.5,44.85 61.5,42.8 61.3,42.6 59.49,42.6 | U1.28 52.75,37.7 | U1.60 56.25,22.89 v56.77,22.37 57.48,22.37 C2.1 58.15,22.58 57.75,22.98 U1.63 | Q24.P$2 64.97,26.55 65.15,26.55 | v60.2,38 64.85,33.35 64.85,32.48 v64.12,31.76 63.52,31.15 C3.2 62.9,31.25 U1.12
  Top 0.6: R53.2 31.7,10.45 SI2302-9.2 30,10.7 29.14,11.56 | R49.2 31.7,6.95 SI2302-0.2 29.14,7.82 29.14,11.56 | R55.2 62.45,45.8 SI2302-3.2 61.9,47.5 61.04,48.37 59.87,48.37 v58.5,47 58.85,46.65 58.85,45.5 | C19.1 R1.1 50.9,13.4 v49.5,12 | C20.1 40.55,20.2 v38.2,20.2 | v28.8,18 28.85,17.95 SI2302-7.2 | SI2302-8.2 28.85,13.95 v28.8,13.9 29.14,13.56 29.14,11.56 | SI2302-6.2 28.9,28.95 v28.9,28.8 | SI2302-5.2 28.93,31.88 v28.93,31.05 | R16.1 58,15.11 | 58,15.11 58,13.89 59.4,12.49 59.4,10.51 57.41,8.51 v57.01,8.51 | v59.11,15.11 58,15.11 | SI2302-1.2 69.36,62.69 69.36,48.41 SI2302-2.2 68.5,47.29 67.21,46 v66.8,46 | C10.1 65.15,26.55 v65.8,25.9 66.17,25.52 66.17,24.24 66.97,23.45 67.68,23.45 68.6,24.37 C11.P- 71,32.8 | C6.1 52.85,39 | 52.85,39 C9.1 52.75,37.7 | v54.35,38.9 52.95,38.9 52.85,39 | v53,49 53.63,48.37 54.59,48.37 SI2302-4.2 | STAB.P$2 71,32.8 | 71,32.8 C12.P- | v60.2,38 C18.1
  Bottom 0.3: v65.8,25.9 64.12,27.58 v64.12,31.76
  Bottom 0.6: v28.8,18 36,18 v38.2,20.2 44.4,14 44.4,6.46 49.66,1.2 59.35,1.2 61.46,3.31 61.46,12.47 59.11,14.82 v59.11,15.11 59.11,20.03 v56.77,22.37 | v28.8,18 v28.8,13.9 | v28.93,31.05 28.9,31.02 v28.9,28.8 28.9,18.1 v28.8,18 | v57.01,8.51 56.3,7.8 53.19,7.8 49.5,11.49 v49.5,12 49.5,13.98 48.5,14.98 48.5,15.82 49.08,16.4 50.4,16.4 53.5,19.5 53.5,23.5 56,23.5 56,23.14 v56.77,22.37 | v65.8,25.9 62.27,22.37 v56.77,22.37 | v53,49 54.12,47.88 57.62,47.88 v58.5,47 59.5,46 v66.8,46 | v54.35,38.9 59.3,38.9 v60.2,38
  pour Top (isolate 0.3, rank 3, no thermals): 0,92 82,92 82,-0.05 0.25,-0.05 -0.05,0.25
  pour Bottom (isolate 0.3, rank 2, no thermals): 82,92 0,92 0,0.1 82,0.1
GND-4OXV
  Top 0.6: R27.2 SI2302-8.3
GND-BME-EXT
  Top 0.6: SI2302-2.3 R20.2
GND-BME-INT
  Top 0.6: SI2302-5.3 R48.2
GND-COMPR
  Top 0.6: SI2302-9.3 23.85,5.35 | COMPR.2 22.27,3.77 23.85,5.35 | U$6.P$2 23.85,5.35
GND-DOSIM
  Top 0.6: SI2302-4.3 R34.2
GND-HEAT
  Top 0.6: SI2302-3.3 61.5,82.03 HEAT.2
GND-MICS
  Top 0.6: SI2302-7.3 R24.2
GND-MS-EXT
  Top 0.6: R13.2 SI2302-1.3
GND-MS-INT
  Top 0.6: SI2302-6.3 R30.2
GND-OUT  (via drill 0.6)
  Top 0.6: BSK1.6 BSK1.5 44.37,79 v46.65,79 55,79 55,91.25 73,91.25 73,88.5 81.25,80.25 81.25,37.52 75.3,31.57 75.3,25.67 61,11.37 61,8 | 57,5.5 55,5.5 U$21.P$3 55,7.31 51.71,10.6 R1.2 | 57,5.5 59,5.5 U$21.P$7 59,7.5 59.5,8 61,8 | v57,5.2 57,5.5 | U$21.P$9 61,8 | U$21.P$5 57,5.5
  Bottom 0.6: v46.65,79 46.85,79 46.85,40.73 51,36.58 51,36.26 52.82,34.44 52.82,32.67 52.5,32.35 48.16,32.35 46.26,34.25 45.36,34.25 43.4,32.28 43.4,22.46 45.04,20.82 49.18,20.82 49.65,20.35 46.2,16.9 46.2,15.2 45.7,14.7 45.7,7 50.2,2.5 54.3,2.5 v57,5.2
GND-VALVE
  Top 0.6: SI2302-0.3 28,5.7 29.43,4.27 30.2,4.27 VALVE1.2 37.5,2.2 38.76,3.46 | 38.76,3.46 40.7,3.46 41.96,2.2 VALVE2.2 | U$24.P$2 37.55,4.67 38.76,3.46
HEAT
  Top 0.3: U1.11 61.85,30.75 62.35,30.25 63.65,30.25 65.35,31.95 65.35,33.56 62.95,35.96 62.95,42.9 R56.1
MICS  (via drill 0.35)
  Top 0.3: v48,24.3 46.13,22.43 45.1,22.43 40.52,17.85 R23.1 | U1.44 49.74,27.75 49.95,27.96 v50.77,27.96
  Bottom 0.3: v50.77,27.96 50.55,27.73 50.2,27.73 49.77,27.3 49.77,25.98 v48,24.3
MS5611-EXT
  Top 0.3: R31.1 63.5,63.95 63.5,36.11 65.85,33.76 65.85,31.75 63.85,29.75 U1.9
MS5611-INT  (via drill 0.35)
  Top 0.3: R29.1 39.09,28.85 43.61,33.37 v45.9,33.37 | v53.7,33.47 53.75,33.52 U1.26
  Bottom 0.3: v45.9,33.37 46.13,33.14 46.36,33.14 47.8,31.7 53.08,31.7 53.7,32.32 v53.7,33.47
N$1
  Top 0.6: R13.1 78.19,64.5 MS5611.P$3 78.23,63.78 79.49,62.52 79.49,58.18 MS5611.P$6
N$2
  Top 0.3: R14.1 66.85,49.1 R19.2 67,49.45 SI2302-2.1
N$3
  Top 0.6: R20.1 78.04,48.5 BME280.P$2
N$4
  Top 0.3: Q24.P$3 63.17,26.05 C8.2
N$5
  Top 0.3: C8.1 U1.5
N$6
  Top 0.3: SI2302-7.1 31.7,16.05 R21.1 R23.2
N$7
  Top 0.3: SI2302-0.1 31.7,5.05 R49.1 R50.2
N$8
  Top 0.3: SI2302-8.1 31.7,12.05 R25.1 R26.2
N$9  (via drill 0.35)
  Top 0.3: v64.12,33 63.15,33 C3.1 61.9,31.75 U1.13
  Top 0.6: STAB.P$5 68.6,36.85 v68.6,36 C11.P+
  Bottom 0.3: v64.12,33 67.12,36 v68.6,36
N$10
  Top 0.3: SI2302-5.1 31.7,31.05 R46.1 R47.2
N$11
  Top 0.3: SI2302-1.1 67,65.45 R31.2 65.15,63.9 R22.1
N$12
  Top 0.3: SI2302-6.1 31.7,27.05 R28.1 R29.2
N$13
  Top 0.3: R16.2 57.9,18.25 LED-G.C
N$14
  Top 0.3: R33.2 R32.1 53.55,45.8 SI2302-4.1
N$15
  Top 0.3: U2.2 40.37,55.13 41.63,53.87 U2.6 43.99,53.24 44.46,53.24 44.7,53 44.7,49.61 43.4,48.3 R2.1 41.7,49.85 C1.2
N$16
  Top 0.3: VR1.3 VR1.2 34.65,50.75 41.55,50.75 42.45,49.85 R2.2
N$17
  Top 0.3: R3.2 34.19,49.85 31.44,52.6 31.44,53.96 VR1.1 31.54,53.87 31.91,53.87 33.8,55.76 34.6,55.76 36.5,53.86 36.5,52.79 37.34,51.95 39.52,51.95 39.77,52.19 39.77,53 39.52,53.24 39.05,53.24 U2.3
N$18
  Top 0.3: R3.1 37,46.75 37,42.04 36.5,41.54 36.5,41.5 36.46,41.5 36.36,41.4 35.44,41.4 33.6,43.24 33.6,44.45 30.11,44.45 28.66,43 2N6517.2
N$19
  Top 0.3: 2N6517.3 23.8,42.58 23.8,43.46 24.74,44.4 27.5,44.4 27.5,45.9 | 27.5,45.9 C4.1 32.3,45.5 U$10.P$2 U$11.P$1 | U$17.P$2 26.2,56.17 27.5,54.87 27.5,45.9
N$20
  Top 0.3: C5.1 42,42.6 U$12.P$1 U$11.P$2
N$21
  Top 0.3: C4.2 32.3,43.1 U$12.P$2 U$13.P$1
N$22
  Top 0.3: U$14.P$1 41.9,36.5 U$13.P$2 38.67,36.5 36.76,34.6 35.04,34.6 33.3,36.34 33.3,38.95 31.69,40.55 25.53,40.55 24.61,39.63 15.22,39.63 R4.2
  Top 0.6: R4.2 R5.2
N$23
  Top 0.6: D1.C D2.A
N$24
  Top 0.6: D2.C D3.A
N$25
  Top 0.6: D3.C D4.A
N$26
  Top 0.6: D4.C D5.A
N$27  (via drill 0.35)
  Top 0.3: D5.C v18,41.5 | v11.5,40 11.5,41.35 R4.1
  Bottom 0.3: v18,41.5 13,41.5 v11.5,40
N$28
  Top 0.6: R5.1 R6.1
N$29
  Top 0.3: U1.47 46.6,26.25 C13.2
N$30
  Top 0.6: R6.2 R7.2
N$31
  Top 0.6: R7.1 R8.1
N$32
  Top 0.6: R8.2 R9.2
N$33
  Top 0.6: R9.1 3.75,60.4 U$15.P$1
N$34
  Top 0.3: BC546.2 24.9,49.9 25.75,49.05 25.75,47.66 24.9,46.8 C7.1
  Top 0.6: 12.29,56.3 7.25,61.34 U$15.P$2 | R35.1 11.65,55.66 12.29,56.3 | BC546.2 24.9,54 22.6,56.3 12.29,56.3
N$36
  Top 0.3: U1.31 51.25,37.7 C9.2
N$37
  Top 0.3: LED-B.C 53.6,16.65 R15.2
N$38
  Top 0.3: R15.1 54,21.47 52.75,22.72 U1.53
N$47
  Top 0.3: SI2302-9.1 31.7,8.55 R53.1 R54.2
N$48
  Top 0.3: SI2302-3.1 60.55,45.8 R55.1 R56.2
NH3  (via drill 0.35)
  Top 0.3: U$16.P$8 R38.1 24.05,23.9 36.97,23.9 43.5,30.43 v44.27,30.43 | v58.13,32.5 58.38,32.75 U1.15
  Bottom 0.3: v44.27,30.43 44.43,30.27 46.23,30.27 46.8,29.7 56.53,29.7 58.08,31.25 58.08,32.45 v58.13,32.5
NO2  (via drill 0.35)
  Top 0.3: U$16.P$9 20.85,23.5 R37.1 23.65,26.3 26.94,26.3 27.34,26.7 28.51,26.7 29.81,28 38.95,28 43.59,32.64 v45,32.64 | v57.35,31.55 57.57,31.77 58.43,31.77 58.91,32.25 U1.14
  Bottom 0.3: v45,32.64 46.15,32.64 47.59,31.2 53.28,31.2 54.46,32.37 54.46,33.52 55.07,34.13 56.6,34.13 57.36,33.37 v57.36,31.56 v57.35,31.55
NRST  (via drill 0.35)
  Top 0.3: R10.1 v64.3,19.5 59.09,24.71 59.09,28.51 59.32,28.75 U1.7 | v63,5.4 U$21.P$11
  Bottom 0.3: v63,5.4 64.3,6.7 64.3,8.54 63,9.84 63,13.16 64.3,14.46 v64.3,19.5
O2  (via drill 0.35)
  Top 0.3: U$16.P$3 19.75,17.5 21.95,15.3 39.09,15.3 v45.4,21.7 | v59,36.5 58.5,36.5 58.25,36.25 U1.17
  Bottom 0.3: v45.4,21.7 47.27,23.57 47.27,24.6 49.27,26.6 49.27,27.68 50.28,28.7 58.79,28.7 61.23,31.13 61.23,34.3 60.8,34.73 60.77,34.73 v59,36.5
RX-S  (via drill 0.35)
  Top 0.3: U$21.P$4 56,7.61 54.2,9.41 54.2,13.44 52.14,15.5 51.25,15.5 50.75,16 50.75,19.54 51.14,19.94 v51.14,20.5 | U1.52 52.25,22.51 52.6,22.16 v52.6,20.5
  Bottom 0.3: v52.6,20.5 v51.14,20.5
SCL-TM  (via drill 0.35)
  Top 0.3: v51.9,33.36 52.25,33.71 U1.29
  Bottom 0.3: BSK1.7 45.79,80.12 45.79,78.65 46.2,78.24 46.2,40.46 50.35,36.31 50.35,35.99 51.9,34.44 v51.9,33.36
SDA-TM  (via drill 0.35)
  Top 0.3: U1.30 51.75,36.25 v52,36.5
  Bottom 0.3: v52,36.5 47.5,41 47.5,79.38 46.24,80.64 46.24,82.21 BSK1.8
SENS-EXT-SCL  (via drill 0.35)
  Top 0.3: v52.4,27.6 50.75,29.25 U1.41 | MS5611.P$5 77.12,58.35 77.12,50.07 77.79,49.4 78.71,49.4 79.36,48.75 79.36,47.83 78.25,46.72 BME280.P$3 78.2,45.8 R58.2
  Bottom 0.3: BME280.P$3 74.25,45.75 61.73,33.23 61.73,30.93 59,28.2 53,28.2 v52.4,27.6
SENS-EXT-SDA  (via drill 0.35)
  Top 0.3: MS5611.P$4 77.56,62 74.25,58.69 74.25,47.01 74.05,46.8 73,46.8 73,44 73.05,44 R57.2 BME280.P$4 | U1.40 51.28,29.75 53.4,27.63 v53.4,27.2
  Bottom 0.3: BME280.P$4 72.42,43.21 62.23,33.02 62.23,30.72 59.2,27.7 53.9,27.7 v53.4,27.2
SENS-INT-SCL
  Top 0.3: R17.2 60.1,18.98 58.73,20.35 55.65,20.35 55.25,20.75 U1.58 55.25,26.5 50,31.75 50,33.43 49.33,34.1 42.1,34.1 37.7,29.7 22.16,29.7 18.95,26.5 U$16.P$12
SENS-INT-SDA
  Top 0.3: R18.2 59.7,20.85 55.9,20.85 55.75,21 U1.59 55.75,26.71 50.57,31.89 50.57,33.57 49.54,34.6 41.89,34.6 37.49,30.2 21.95,30.2 19.25,27.5 U$16.P$13
SWC
  Top 0.3: U$21.P$10 61.65,6.3 61.65,5.86 60.14,4.35 53.64,4.35 52.07,2.77 50.33,2.77 49.55,3.55 45.95,7.15 45.95,14.68 46.5,15.23 46.5,17.3 46.7,17.5 48.65,17.5 R12.1 49.5,19 50.41,19.91 50.41,22.41 50.75,22.75 U1.49
SWD  (via drill 0.35)
  Top 0.3: v59.98,5.4 60,5.42 U$21.P$8 | v59,3.3 57.97,2.27 50.12,2.27 45.45,6.94 45.45,14.88 46,15.43 46,16 46,17.5 46.85,18.35 R11.1 49.91,20.86 49.91,26.51 49.68,26.75 U1.46
  Bottom 0.3: v59.98,5.4 59.98,4.28 v59,3.3
TEMP
  Top 0.3: U1.20 56.75,36.85 56.25,37.35 56.25,38.65 57.15,39.55 R52.1 R51.2 57.15,89.38 TEMP.1
TIME  (via drill 0.35)
  Top 0.3: U1.50 51.25,24.68 52.02,25.45 v52.02,26.14 | v57.02,26.97 57.02,29.5 56.62,29.9 56.62,32.02 58.09,33.49 v58.09,33.51
  Bottom 0.3: BSK1.9 47.35,80.23 48,79.58 48,41.53 54.59,34.94 56.49,34.94 57.92,33.51 v58.09,33.51 | v57.02,26.97 55.47,25.41 52.75,25.41 v52.02,26.14
TX-S
  Top 0.3: U$21.P$6 58,7.09 57.45,7.65 56.67,7.65 54.75,9.57 54.75,10.95 54.7,11 54.7,13.64 52.34,16 51.45,16 51.25,16.2 51.25,19.34 51.87,19.96 51.87,22.18 51.75,22.31 U1.51
VALVE  (via drill 0.35)
  Top 0.3: U1.61 56.75,25.45 v56.7,25.5 | R50.1 34,7.1 35.45,8.55 35.45,8.95 35.66,9.15 36.05,9.15 v49.1,22.2
  Bottom 0.3: v56.7,25.5 56.12,24.91 51.81,24.91 v49.1,22.2

### Text on the board
tPlace: to BSK1 | to Sealed / housing | PC12 | PWR | for / firmware